# Altium project ControlBoard.PrjPcb
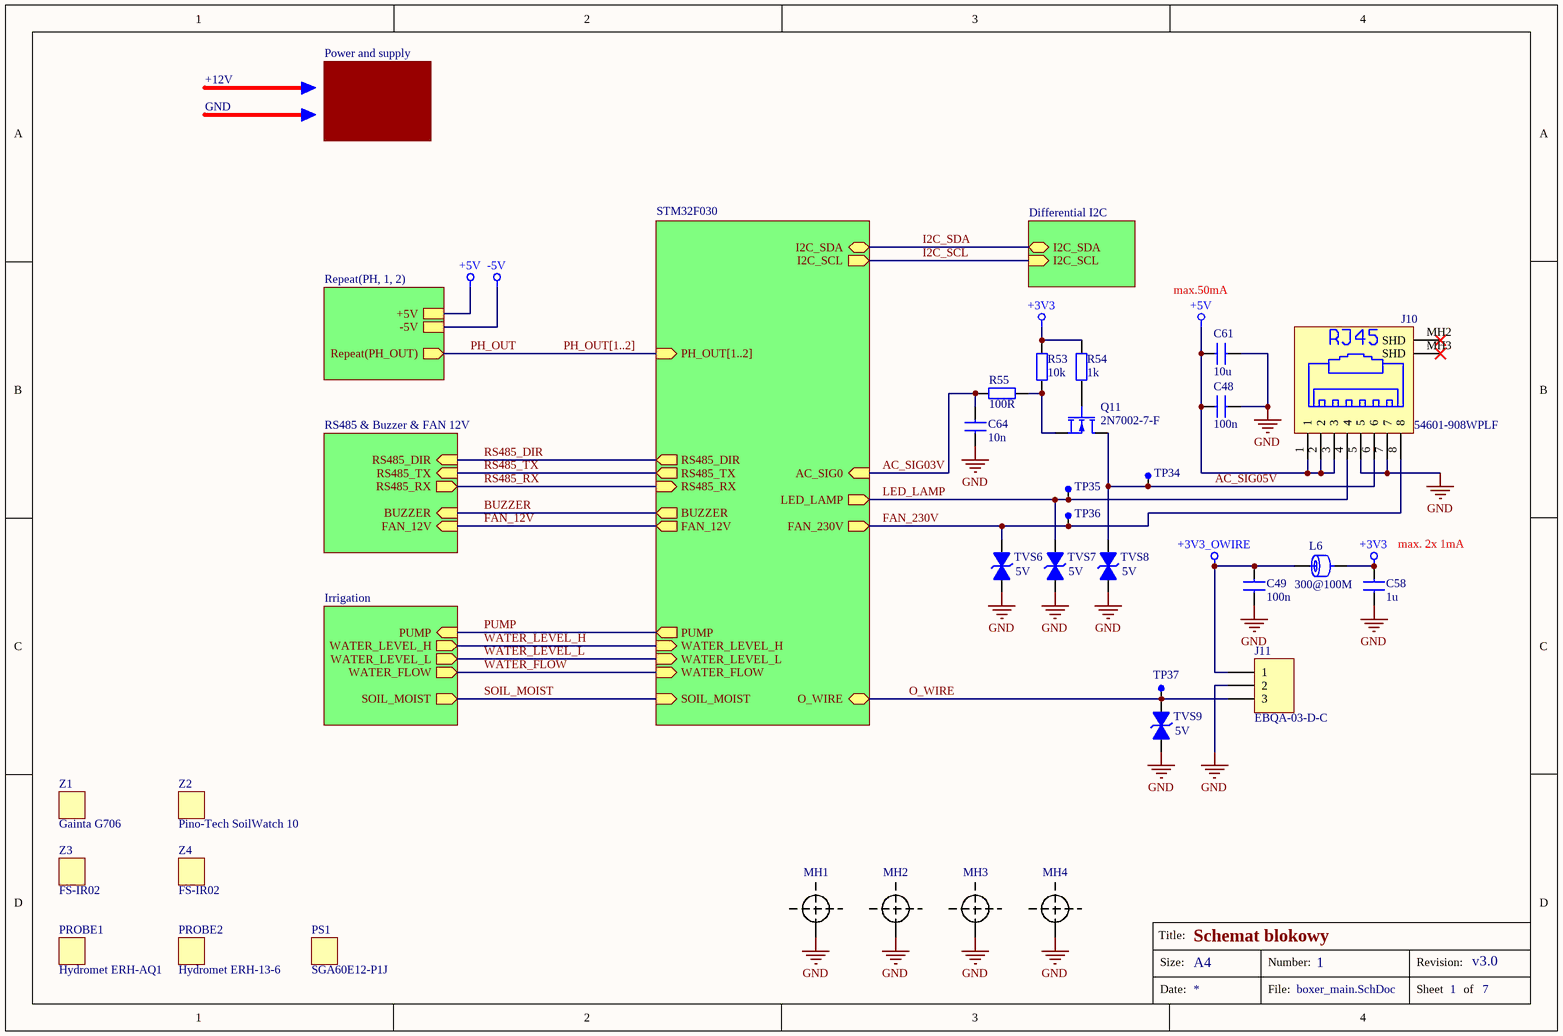
[diagram p0: boxer_main.SchDoc]
Revision: v3.0
7 sheets, 264 parts. Net scope: hierarchical (ports join the sheet entries above them; power ports are global).
Board file: PCB.PcbDoc
Sheets:
  boxer_main.SchDoc
    Irrigation = boxer_irrigation.SchDoc
    STM32F030 = boxer_stm32.SchDoc
    PH1 = boxer_pH.SchDoc
    PH2 = boxer_pH.SchDoc
    Power and supply = boxer_supply.SchDoc
    RS485 & Buzzer & FAN 12V = boxer_analog.SchDoc
    Differential I2C = boxer_I2C_diff.SchDoc

## Sheet boxer_main.SchDoc: Schemat blokowy
size A4; DrawnBy: Damian Dolewski; Engineer: Damian Dolewski; DocumentNumber: 1; Revision: v3.0; SheetNumber: 1; SheetTotal: 7

### Parts
C48  value 100n  [C_0805]  (hidden comment: Capacitor)
C49  value 100n  [C_0805]  (hidden comment: Capacitor)
C58  value 1u  [C_0805]  (hidden comment: C0805C105K4RACAUTO)
C61  value 10u  [C_1206]  (hidden comment: Capacitor)
C64  value 10n  [C_0805]  (hidden comment: Capacitor)
J10  54601-908WPLF  [RJ45_54601-908WPLF]
J11  EBQA-03-D-C  [284512-3]
L6  value 300@100M  [L_0805]  (hidden comment: 742792031)
MH1  Mounting hole  [MH_M2.5]  (value not drawn)
MH2  Mounting hole  [MH_M2.5]  (value not drawn)
MH3  Mounting hole  [MH_M2.5]  (value not drawn)
MH4  Mounting hole  [MH_M2.5]  (value not drawn)
PROBE1  Hydromet ERH-AQ1  (mechanical)
PROBE2  Hydromet ERH-13-6  (mechanical)
PS1  SGA60E12-P1J  (mechanical)
Q11  2N7002-7-F  [SOT-23]
R53  value 10k  [R_1206]  (hidden comment: Resistor)
R54  value 1k  [R_0805]  (hidden comment: Resistor)
R55  value 100R  [R_0805]  (hidden comment: Resistor)
TP34  TEST PAD  [PIN]  (value not drawn)
TP35  TEST PAD  [PIN]  (value not drawn)
TP36  TEST PAD  [PIN]  (value not drawn)
TP37  TEST PAD  [PIN]  (value not drawn)
TVS6  value 5V  [D_SMA]  (hidden comment: SMAJ5.0ALFCT-ND)
TVS7  value 5V  [D_SMA]  (hidden comment: SMAJ5.0ALFCT-ND)
TVS8  value 5V  [D_SMA]  (hidden comment: SMAJ5.0ALFCT-ND)
TVS9  value 5V  [D_SMA]  (hidden comment: SMAJ5.0ALFCT-ND)
Z1  Gainta G706  [Gainta G706]
Z2  Pino-Tech SoilWatch 10  (mechanical)
Z3  FS-IR02  (mechanical)
Z4  FS-IR02  (mechanical)

### Sub-sheets
Differential I2C = boxer_I2C_diff.SchDoc: I2C_SDA (bidir), I2C_SCL (in)
Irrigation = boxer_irrigation.SchDoc: SOIL_MOIST (out), PUMP (in), WATER_FLOW (out), WATER_LEVEL_H (out), WATER_LEVEL_L (out)
Power and supply = boxer_supply.SchDoc: no entries
Repeat(PH, 1, 2) = boxer_pH.SchDoc: Repeat(PH_OUT) (out), +5V, -5V
RS485 & Buzzer & FAN 12V = boxer_analog.SchDoc: BUZZER (in), FAN_12V (in), RS485_TX (in), RS485_RX (out), RS485_DIR (in)
STM32F030 = boxer_stm32.SchDoc: WATER_FLOW (in), SOIL_MOIST (in), BUZZER (out), PUMP (out), FAN_12V (out), O_WIRE (bidir), FAN_230V (out), AC_SIG0 (in), I2C_SDA (bidir), LED_LAMP (out), I2C_SCL (out), RS485_DIR (out), RS485_TX (out), RS485_RX (in), PH_OUT[1..2] (in), WATER_LEVEL_H (in), WATER_LEVEL_L (in)

### Nets
+3V3: C58.2 L6.2 R53.2 R54.2
+3V3_OWIRE: C49.1 J11.1 L6.1
+5V: C48.2 C61.2 J10.1 J10.2 J10.3 ; sheet Repeat(PH, 1, 2)/+5V
GND: C48.1 C49.2 C58.1 C61.1 C64.2 J10.5 J10.7 J11.2 MH1.MH MH2.MH MH3.MH MH4.MH TVS6.1(A) TVS7.1(A) TVS8.1(A) TVS9.1(A)
AC_SIG03V: C64.1 R55.2 ; sheet STM32F030/AC_SIG0
AC_SIG05V: J10.6 Q11.3(D) TP34.1 TVS8.2(K)
BUZZER: sheet STM32F030/BUZZER, sheet RS485 & Buzzer & FAN 12V/BUZZER
FAN_12V: sheet STM32F030/FAN_12V, sheet RS485 & Buzzer & FAN 12V/FAN_12V
FAN_230V: J10.8 TP36.1 TVS6.2(K) ; sheet STM32F030/FAN_230V
I2C_SCL: sheet STM32F030/I2C_SCL, sheet Differential I2C/I2C_SCL
I2C_SDA: sheet STM32F030/I2C_SDA, sheet Differential I2C/I2C_SDA
LED_LAMP: J10.4 TP35.1 TVS7.2(K) ; sheet STM32F030/LED_LAMP
O_WIRE: J11.3 TP37.1 TVS9.2(K) ; sheet STM32F030/O_WIRE
PH_OUT: sheet Repeat(PH, 1, 2)/Repeat(PH_OUT)
PUMP: sheet Irrigation/PUMP, sheet STM32F030/PUMP
RS485_DIR: sheet STM32F030/RS485_DIR, sheet RS485 & Buzzer & FAN 12V/RS485_DIR
RS485_RX: sheet STM32F030/RS485_RX, sheet RS485 & Buzzer & FAN 12V/RS485_RX
RS485_TX: sheet STM32F030/RS485_TX, sheet RS485 & Buzzer & FAN 12V/RS485_TX
SOIL_MOIST: sheet Irrigation/SOIL_MOIST, sheet STM32F030/SOIL_MOIST
WATER_FLOW: sheet Irrigation/WATER_FLOW, sheet STM32F030/WATER_FLOW
WATER_LEVEL_H: sheet Irrigation/WATER_LEVEL_H, sheet STM32F030/WATER_LEVEL_H
WATER_LEVEL_L: sheet Irrigation/WATER_LEVEL_L, sheet STM32F030/WATER_LEVEL_L
NetQ11_1: Q11.1(G) R54.1
NetQ11_2: Q11.2(S) R53.1 R55.1

Not connected (* = marked no-connect by the designer): J10 MH2(SHD)* MH3(SHD)*

### Buses and harness runs
bus PH_OUT[1..2] = sheet STM32F030/PH_OUT[1..2]

### Notes on the sheet
- +12V
- GND
- max.50mA
- (near C58) max. 2x 1mA
- Title:
- Size:
- A4
- Number:
- Revision:
- Date:
- File:
- Sheet
- of

### Library data of the parts
C58 = Capacitor
J10 = RJ45-8: RJ45 Socket, 8pin, No Key, Molex MX-95001-2881; Value: 54601-908WPLF
J11 = Header 3: Header, 3-Pin; Value: EBQA-03-D-C
L6 = FB: Ferrite Bead
MH1-MH4 = Mounting hole: Mounting hole 2.3mm
PROBE1 = ERH-AQ1: Hydromet ERH-AQ1 Water pH probe
PROBE2 = ERH-13-6: Hydromet ERH-AQ1 Soil pH probe
PS1 = EPS-45-12
Q11 = MOSFET-N: N-Channel MOSFET; Value: 2N7002-7-F
TP34-TP37 = TEST_PAD
TVS6-TVS9 = Transil
Z1 = ENCLOSURE
Z2 = SoilWatch10: Capacitance Water Soil Sensor, 75MHz; Vcc - 3,1- 5VDC; Vout - analog 0-3VDC; Ioutmax = 24mA; Temp. = 2*C - 45*C; IP67
Z3 Z4 = FS-IR02: IR Liquid Level Sensor, Vcc 5VDC; Iout = 12mA; Temp. = -25*C - 105*C

## Sheet boxer_irrigation.SchDoc: Irrigation Module
size A3; DrawnBy: Damian Dolewski; DocumentNumber: 1; Revision: v3.0; SheetNumber: 5; SheetTotal: 7
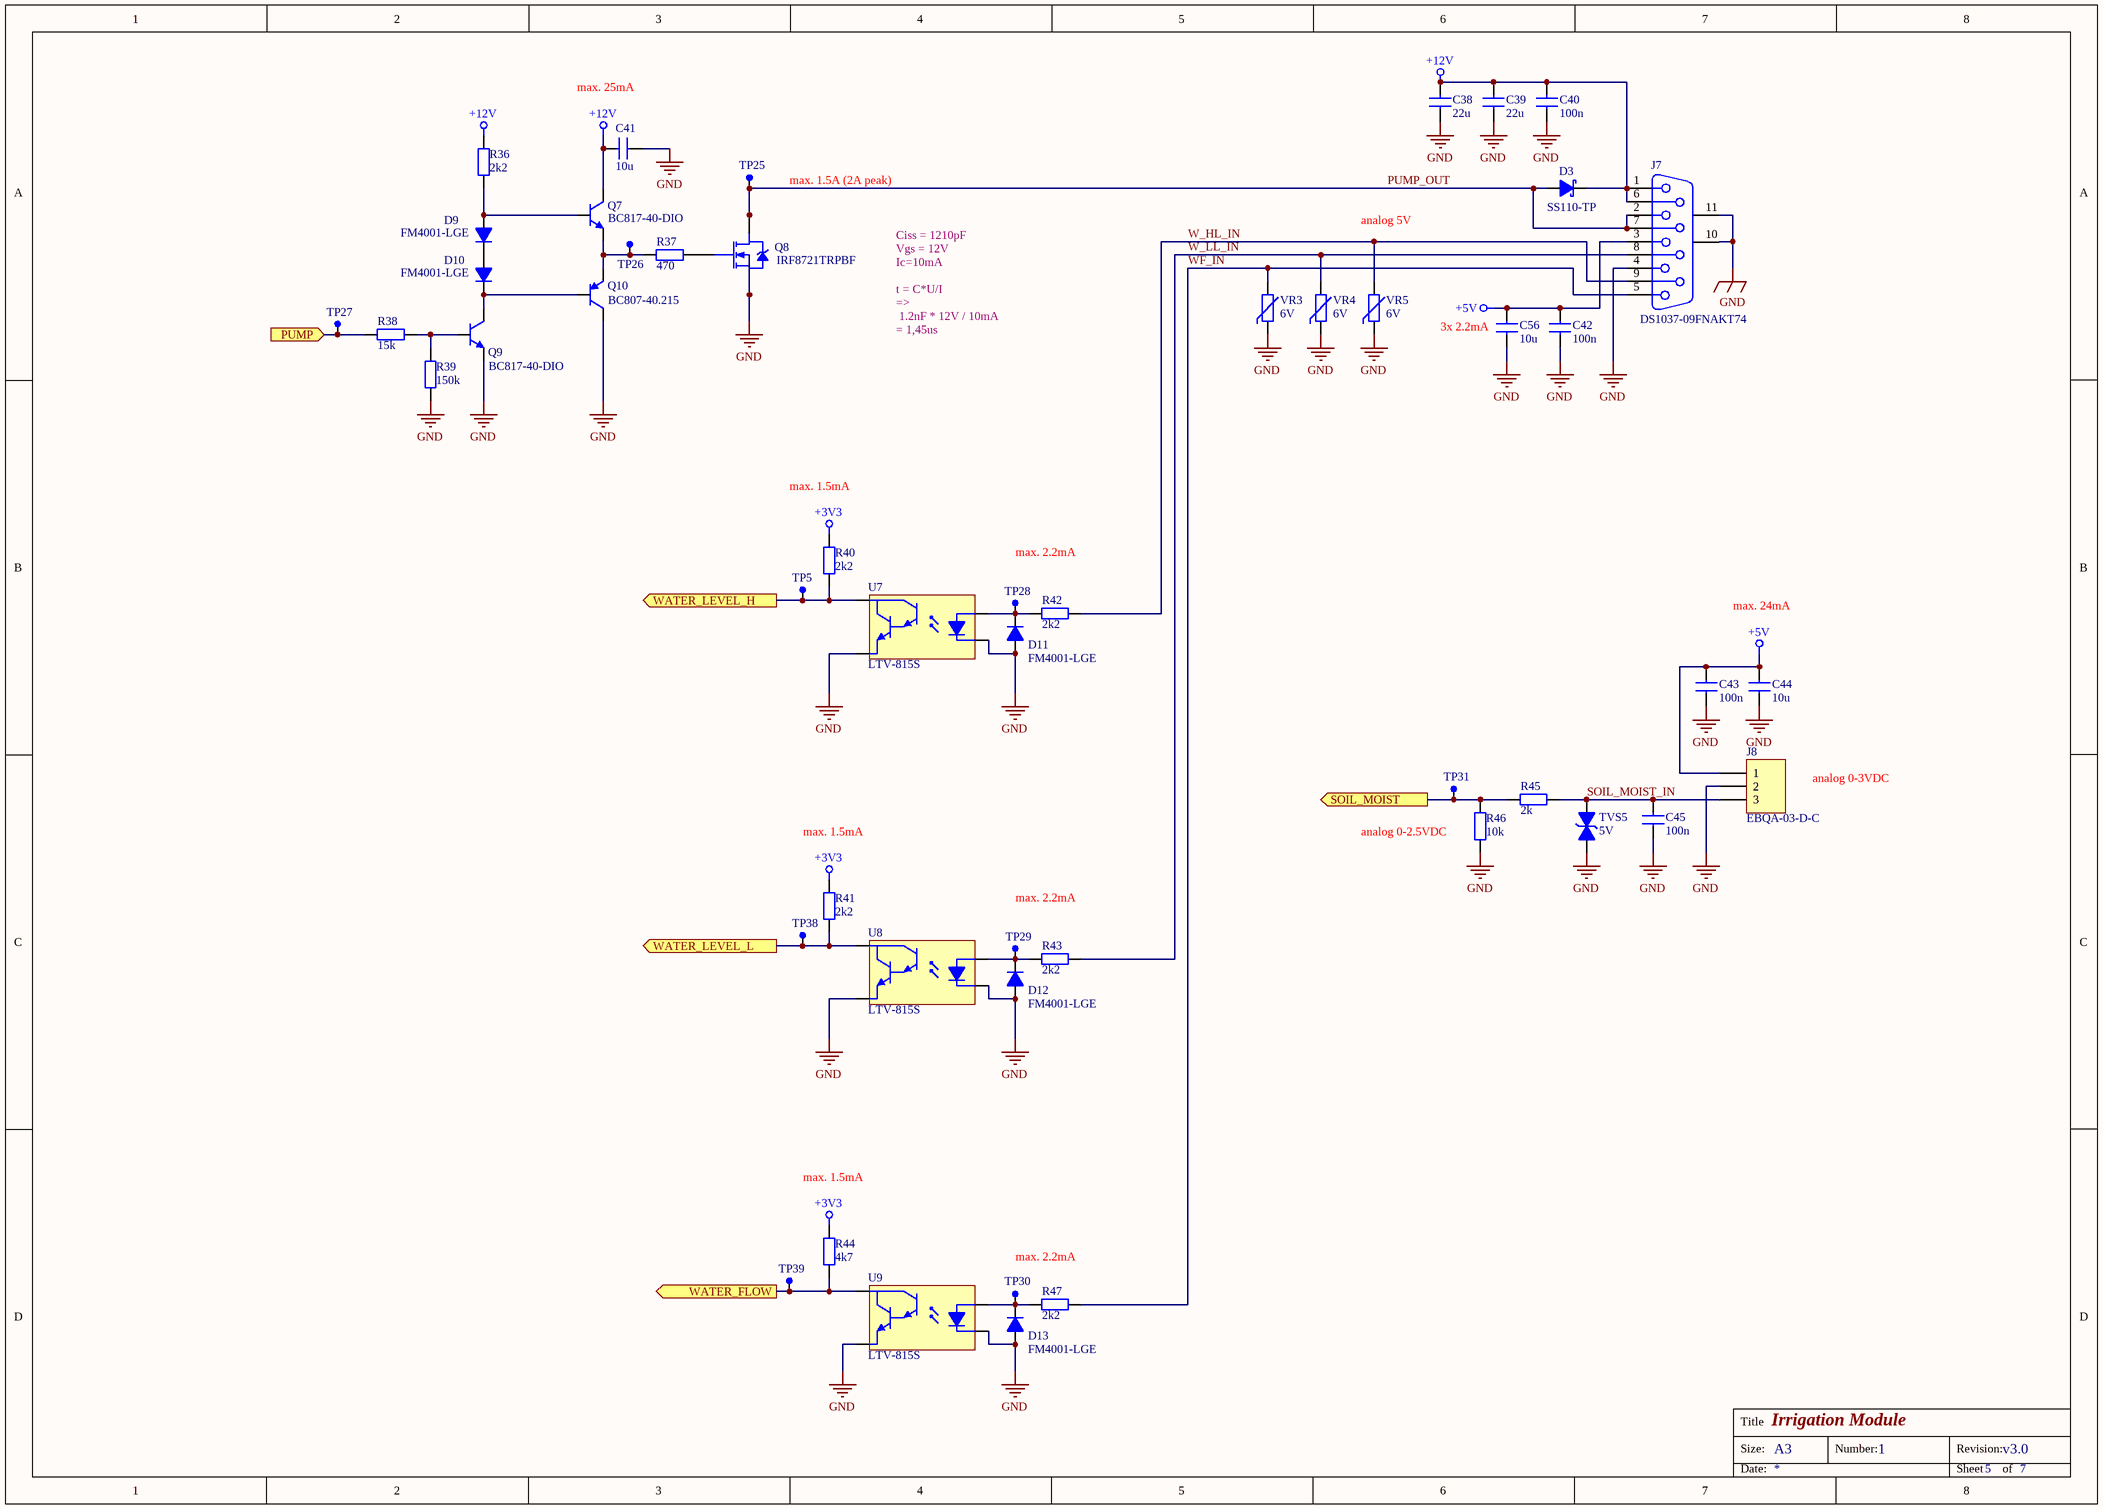
[diagram p1: boxer_irrigation.SchDoc]

### Parts
C38  value 22u  [C_1206]  (hidden comment: TME: CL31A226MOCLNNC)
C39  value 22u  [C_1206]  (hidden comment: TME: CL31A226MOCLNNC)
C40  value 100n  [C_0805]  (hidden comment: Capacitor)
C41  value 10u  [C_1206]  (hidden comment: TME: CL31A226MOCLNNC)
C42  value 100n  [C_0805]  (hidden comment: Capacitor)
C43  value 100n  [C_0805]  (hidden comment: Capacitor)
C44  value 10u  [C_1206]  (hidden comment: TME: CL31A226MOCLNNC)
C45  value 100n  [C_0805]  (hidden comment: Capacitor)
C56  value 10u  [C_1206]  (hidden comment: TME: CL31A226MOCLNNC)
D3  SS110-TP  [D_SMA]
D9  FM4001-LGE  [SOD123F]
D10  FM4001-LGE  [SOD123F]
D11  FM4001-LGE  [SOD123F]
D12  FM4001-LGE  [SOD123F]
D13  FM4001-LGE  [SOD123F]
J7  DS1037-09FNAKT74  [DB9]
J8  EBQA-03-D-C  [284512-3]
Q7  BC817-40-DIO  [SOT-23]
Q8  IRF8721TRPBF  [SO8]
Q9  BC817-40-DIO  [SOT-23]
Q10  BC807-40.215  [SOT-23]
R36  value 2k2  [R_0805]  (hidden comment: Resistor)
R37  value 470  [R_1206]  (hidden comment: Resistor)
R38  value 15k  [R_0805]  (hidden comment: Resistor)
R39  value 150k  [R_0805]  (hidden comment: Resistor)
R40  value 2k2  [R_0805]  (hidden comment: Resistor)
R41  value 2k2  [R_0805]  (hidden comment: Resistor)
R42  value 2k2  [R_0805]  (hidden comment: Resistor)
R43  value 2k2  [R_0805]  (hidden comment: Resistor)
R44  value 4k7  [R_0805]  (hidden comment: Resistor)
R45  value 2k  [R_0805]  (hidden comment: Resistor)
R46  value 10k  [R_1206]  (hidden comment: Resistor)
R47  value 2k2  [R_0805]  (hidden comment: Resistor)
TP5  TEST PAD  [PIN]  (value not drawn)
TP25  TEST PAD  [PIN]  (value not drawn)
TP26  TEST PAD  [PIN]  (value not drawn)
TP27  TEST PAD  [PIN]  (value not drawn)
TP28  TEST PAD  [PIN]  (value not drawn)
TP29  TEST PAD  [PIN]  (value not drawn)
TP30  TEST PAD  [PIN]  (value not drawn)
TP31  TEST PAD  [PIN]  (value not drawn)
TP38  TEST PAD  [PIN]  (value not drawn)
TP39  TEST PAD  [PIN]  (value not drawn)
TVS5  value 5V  [D_SMA]  (hidden comment: SMAJ5.0ALFCT-ND)
U7  LTV-815S  [SO4]
U8  LTV-815S  [SO4]
U9  LTV-815S  [SO4]
VR3  value 6V  [VR_0805]  (hidden comment: AMCV-0805-260-C800N-T)
VR4  value 6V  [VR_0805]  (hidden comment: AMCV-0805-260-C800N-T)
VR5  value 6V  [VR_0805]  (hidden comment: AMCV-0805-260-C800N-T)

### Ports
PUMP (in), SOIL_MOIST (out), WATER_FLOW (out), WATER_LEVEL_H (out), WATER_LEVEL_L (out)

### Nets
+3V3: R40.2 R41.2 R44.2
+5V: C42.2 C43.2 C44.2 C56.1 J7.3 J8.1
+12V: C38.2 C39.2 C40.2 C41.1 D3.2(K) J7.1 J7.6 Q7.3(C) R36.2
GND: C38.1 C39.1 C40.1 C41.2 C42.1 C43.1 C44.1 C45.1 C56.2 D11.1(A) D12.1(A) D13.1(A) J7.4 J7.10(MH1) J7.11(MH2) J8.2 Q8.1(S) Q8.2(S) Q8.3(S) Q9.2(E) Q10.3(C) R39.1 R46.1 TVS5.1(A) U7.2(K) U7.4(E) U8.2(K) U8.4(E) U9.2(K) U9.4(E) VR3.2 VR4.2 VR5.2
PUMP: R38.1 TP27.1 ; port PUMP
PUMP_OUT: D3.1(A) J7.2 J7.7 Q8.5(D) Q8.6(D) Q8.7(D) Q8.8(D) TP25.1
SOIL_MOIST: R45.1 R46.2 TP31.1 ; port SOIL_MOIST
SOIL_MOIST_IN: C45.2 J8.3 R45.2 TVS5.2(K)
W_HL_IN: J7.9 R42.1 VR5.1
W_LL_IN: J7.8 R43.1 VR4.1
WATER_FLOW: R44.1 TP39.1 U9.3(C) ; port WATER_FLOW
WATER_LEVEL_H: R40.1 TP5.1 U7.3(C) ; port WATER_LEVEL_H
WATER_LEVEL_L: R41.1 TP38.1 U8.3(C) ; port WATER_LEVEL_L
WF_IN: J7.5 R47.1 VR3.1
NetD9_1: D9.1(A) Q7.1(B) R36.1
NetD9_2: D9.2(K) D10.1(A)
NetD10_2: D10.2(K) Q9.3(C) Q10.1(B)
NetD11_2: D11.2(K) R42.2 TP28.1 U7.1(A)
NetD12_2: D12.2(K) R43.2 TP29.1 U8.1(A)
NetD13_2: D13.2(K) R47.2 TP30.1 U9.1(A)
NetQ7_2: Q7.2(E) Q10.2(E) R37.2 TP26.1
NetQ8_4: Q8.4(G) R37.1
NetQ9_1: Q9.1(B) R38.2 R39.2

### Notes on the sheet
- (near C41) max. 25mA
- max. 1.5A (2A peak)
- analog 5V
- Ciss = 1210pF
  Vgs = 12V
  Ic=10mA
  t = C*U/I
  =>
  1.2nF * 12V / 10mA
  = 1,45us
- (near C56) 3x 2.2mA
- (near R40) max. 1.5mA
- max. 2.2mA
- max. 24mA
- analog 0-3VDC
- (near R41) max. 1.5mA
- analog 0-2.5VDC
- (near R44) max. 1.5mA
- Title
- Size:
- A3
- Number:
- Revision:
- Date:
- Sheet
- of

### Library data of the parts
C38 C39 C41 C44 C56 = Capacitor
D3 = Diode Schottky: Schottky Diode; Value: SS110-TP
D9-D13 = Diode: Value: FM4001-LGE
J7 = DB9: Receptacle Assembly, 9 Position, Right Angle; Value: DS1037-09FNAKT74
J8 = Header 3: Header, 3-Pin; Value: EBQA-03-D-C
Q7 Q9 = NPN: NPN Bipolar Transistor; Value: BC817-40-DIO
Q8 = MOSFET-N_SO8: N-Channel MOSFET; Value: IRF8721TRPBF
Q10 = PNP: Value: BC807-40.215
TP5 TP25-TP31 TP38 TP39 = TEST_PAD: PAD 1.5mm
TVS5 = Transil
U7-U9 = Optocoupler_Darlington: Optocoupler Darlington NPN; Value: LTV-815S
VR3-VR5 = Varistor: 34.5V 20A Varistor 1 Circuit Surface Mount, MLCV 0805 (2012 Metric)

## Sheet boxer_stm32.SchDoc: Microcontroller STM32F030
size A4; DrawnBy: Damian Dolewski; Engineer: Damian Dolewski; DocumentNumber: 2; Revision: v3.0; SheetNumber: 2; SheetTotal: 7
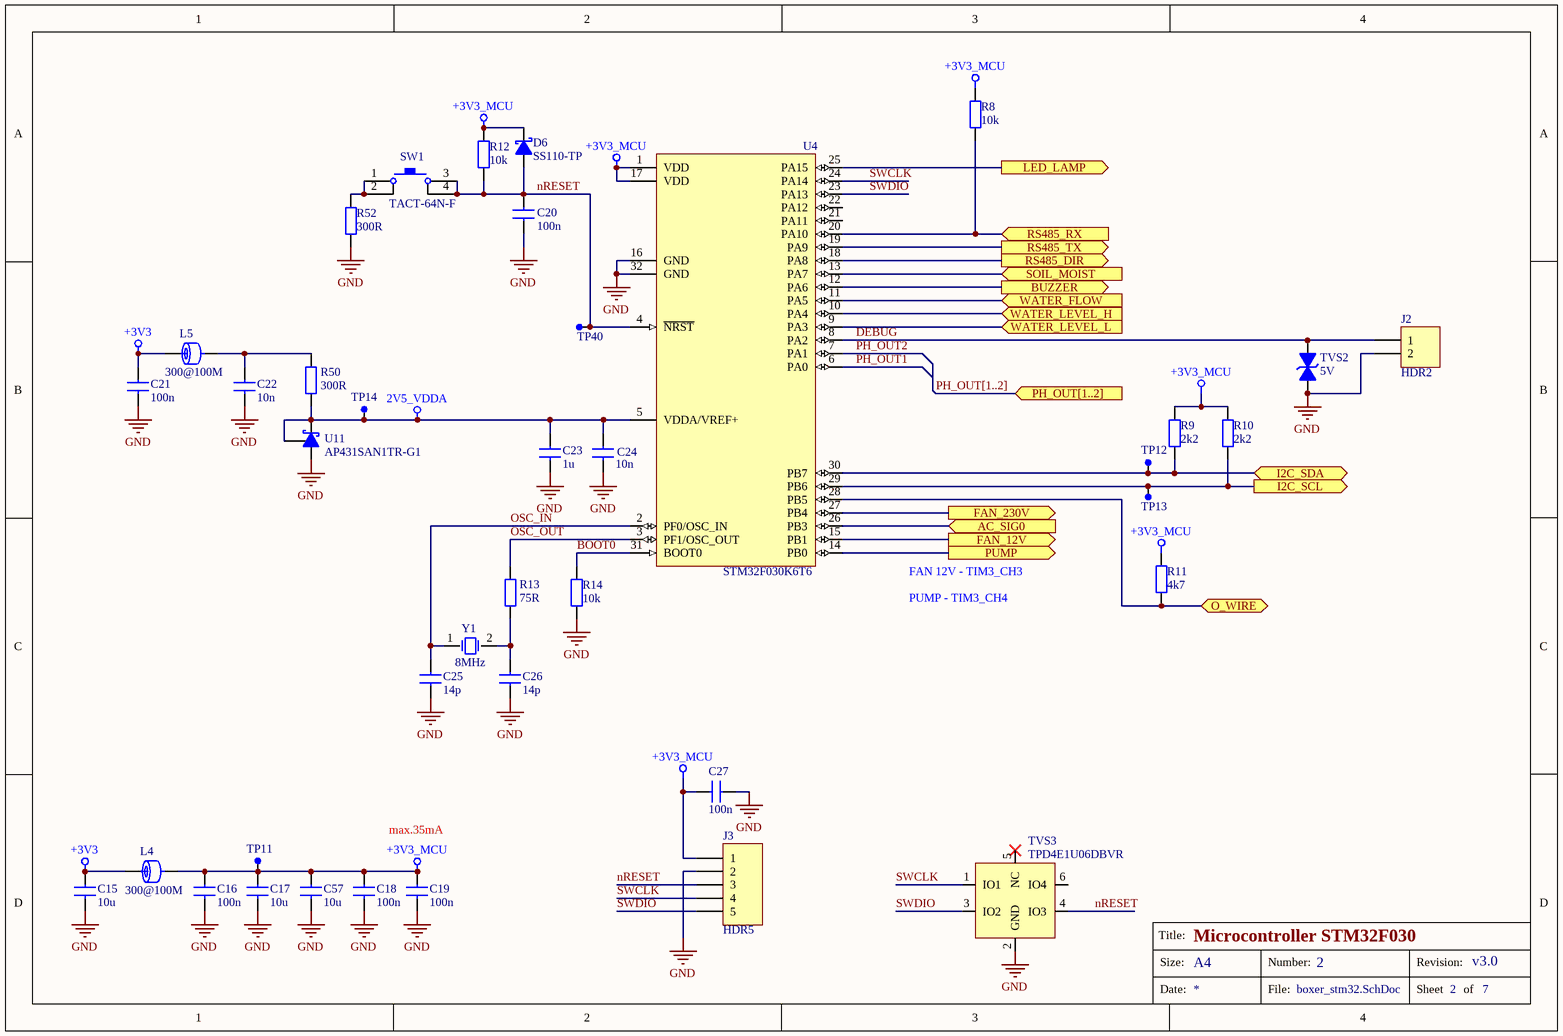
[diagram p2: boxer_stm32.SchDoc]

### Parts
C15  value 10u  [C_1206]  (hidden comment: Capacitor)
C16  value 100n  [C_0805]  (hidden comment: Capacitor)
C17  value 10u  [C_1206]  (hidden comment: TME: CL31A226MOCLNNC)
C18  value 100n  [C_0805]  (hidden comment: Capacitor)
C19  value 100n  [C_0805]  (hidden comment: Capacitor)
C20  value 100n  [C_0805]  (hidden comment: Capacitor)
C21  value 100n  [C_0805]  (hidden comment: Capacitor)
C22  value 10n  [C_0805]  (hidden comment: Capacitor)
C23  value 1u  [C_0805]  (hidden comment: C0805C105K4RACAUTO)
C24  value 10n  [C_0805]  (hidden comment: Capacitor)
C25  value 14p  [C_0805]  (hidden comment: 490-14443-1-ND)
C26  value 14p  [C_0805]  (hidden comment: 490-14443-1-ND)
C27  value 100n  [C_0805]  (hidden comment: Capacitor)
C57  value 10u  [C_1206]  (hidden comment: TME: CL31A226MOCLNNC)
D6  SS110-TP  [D_1206]
J2  value HDR2  [header 2.54mm 2pin]  (hidden comment: Header 2.54mm)
J3  value HDR5  [header 2.54mm 5pin]  (hidden comment: Header 2.54mm)
L4  value 300@100M  [L_0805]  (hidden comment: 742792031)
L5  value 300@100M  [L_0805]  (hidden comment: 742792031)
R8  value 10k  [R_1206]  (hidden comment: Resistor)
R9  value 2k2  [R_0805]  (hidden comment: Resistor)
R10  value 2k2  [R_0805]  (hidden comment: Resistor)
R11  value 4k7  [R_0805]  (hidden comment: Resistor)
R12  value 10k  [R_1206]  (hidden comment: Resistor)
R13  value 75R  [R_0805]  (hidden comment: Resistor)
R14  value 10k  [R_1206]  (hidden comment: Resistor)
R50  value 300R  [R_0805]  (hidden comment: Resistor)
R52  value 300R  [R_0805]  (hidden comment: Resistor)
SW1  TACT-64N-F  [SPST_NO_1301]
TP11  TEST PAD  [PIN]  (value not drawn)
TP12  TEST PAD  [PIN]  (value not drawn)
TP13  TEST PAD  [PIN]  (value not drawn)
TP14  TEST PAD  [PIN]  (value not drawn)
TP40  TEST PAD  [PIN]  (value not drawn)
TVS2  value 5V  [D_SMA]  (hidden comment: SMAJ5.0ALFCT-ND)
TVS3  TPD4E1U06DBVR  [SOT23-6]
U4  STM32F030K6T6  [LQFP-32]
U11  AP431SAN1TR-G1  [SOT-23]
Y1  value 8MHz  [CFPX_217]  (hidden comment: 7A-8.000MAAE-T)

### Ports
AC_SIG0 (in), BUZZER (out), FAN_12V (out), FAN_230V (out), I2C_SCL (out), I2C_SDA (bidir), LED_LAMP (out), O_WIRE (bidir), PH_OUT[1..2] (in), PUMP (out), RS485_DIR (out), RS485_RX (in), RS485_TX (out), SOIL_MOIST (in), WATER_FLOW (in), WATER_LEVEL_H (in), WATER_LEVEL_L (in)

### Nets
2V5_VDDA: C23.2 C24.2 R50.1 TP14.1 U4.5(VDDA/VREF+) U11.1(REF) U11.2(K)
+3V3: C15.2 C21.2 L4.1 L5.1
+3V3_MCU: C16.2 C17.2 C18.2 C19.2 C27.1 C57.1 D6.2(K) J3.1 L4.2 R8.2 R9.2 R10.2 R11.1 R12.2 TP11.1 U4.1(VDD) U4.17(VDD)
GND: C15.1 C16.1 C17.1 C18.1 C19.1 C20.1 C21.1 C22.1 C23.1 C24.1 C25.1 C26.1 C27.2 C57.2 J2.2 J3.2 R14.1 R52.2 TVS2.1(A) TVS3.2(GND) U4.16(GND) U4.32(GND) U11.3(A)
AC_SIG03V: U4.26(PB3) ; port AC_SIG0
BOOT0: R14.2 U4.31(BOOT0)
BUZZER: U4.12(PA6) ; port BUZZER
DEBUG: J2.1 TVS2.2(K) U4.8(PA2)
FAN_12V: U4.15(PB1) ; port FAN_12V
FAN_230V: U4.27(PB4) ; port FAN_230V
I2C_SCL: R10.1 TP13.1 U4.29(PB6) ; port I2C_SCL
I2C_SDA: R9.1 TP12.1 U4.30(PB7) ; port I2C_SDA
LED_LAMP: U4.25(PA15) ; port LED_LAMP
nRESET: C20.2 D6.1(A) J3.3 R12.1 SW1.3 SW1.4 TP40.1 TVS3.4(IO3) U4.4(~{NRST})
O_WIRE: R11.2 U4.28(PB5) ; port O_WIRE
OSC_IN: C25.2 U4.2(PF0/OSC_IN) Y1.1(OSC1)
OSC_OUT: R13.2 U4.3(PF1/OSC_OUT)
PH_OUT1: U4.6(PA0)
PH_OUT2: U4.7(PA1)
PUMP: U4.14(PB0) ; port PUMP
RS485_DIR: U4.18(PA8) ; port RS485_DIR
RS485_RX: R8.1 U4.20(PA10) ; port RS485_RX
RS485_TX: U4.19(PA9) ; port RS485_TX
SOIL_MOIST: U4.13(PA7) ; port SOIL_MOIST
SWCLK: J3.4 TVS3.1(IO1) U4.24(PA14)
SWDIO: J3.5 TVS3.3(IO2) U4.23(PA13)
WATER_FLOW: U4.11(PA5) ; port WATER_FLOW
WATER_LEVEL_H: U4.10(PA4) ; port WATER_LEVEL_H
WATER_LEVEL_L: U4.9(PA3) ; port WATER_LEVEL_L
NetC22_2: C22.2 L5.2 R50.2
NetC26_2: C26.2 R13.1 Y1.2(OSC2)
NetR52_1: R52.1 SW1.1 SW1.2

Not connected (* = marked no-connect by the designer): TVS3 5(NC)* 6(IO4); U4 21(PA11) 22(PA12)

### Buses and harness runs
bus PH_OUT[1..2] = port PH_OUT[1..2]

### Notes on the sheet
- FAN 12V - TIM3_CH3
- PUMP - TIM3_CH4
- max.35mA
- Title:
- Size:
- A4
- Number:
- Revision:
- Date:
- File:
- Sheet
- of

### Library data of the parts
C17 C23 C25 C26 C57 = Capacitor
D6 = Diode Schottky: Schottky Diode; Value: SS110-TP
J2 = Header 2: Header, 2-Pin
J3 = Header 5: Header, 5-Pin
L4 L5 = FB: Ferrite Bead
SW1 = Switch-PB 4 Pins: Switch 4 Pins; Value: TACT-64N-F
TP11 TP14 TP40 = TEST_PAD: PAD 1.5mm
TP12 TP13 = TEST_PAD
TVS2 = Transil
TVS3 = Transil Array_2: TVS Array; Value: TPD4E1U06DBVR
U4 = STM32F030C8T6: Microcontroler ARM; Flash:32kB; 48MHz; SRAM:4kB; LQFP32; Value: STM32F030K6T6
U11 = REF_VOLTAGE: Value: AP431SAN1TR-G1
Y1 = XTAL: Crystal Oscillator

## Sheet boxer_pH.SchDoc: Water and Soil pH meter
size A4; DrawnBy: Damian Dolewski; Engineer: Damian Dolewski; DocumentNumber: 3; Revision: v3.0; SheetNumber: 3; SheetTotal: 7
Used 2 times, as channels PH1, PH2. Parts and nets are listed once, with the designators drawn on the sheet.
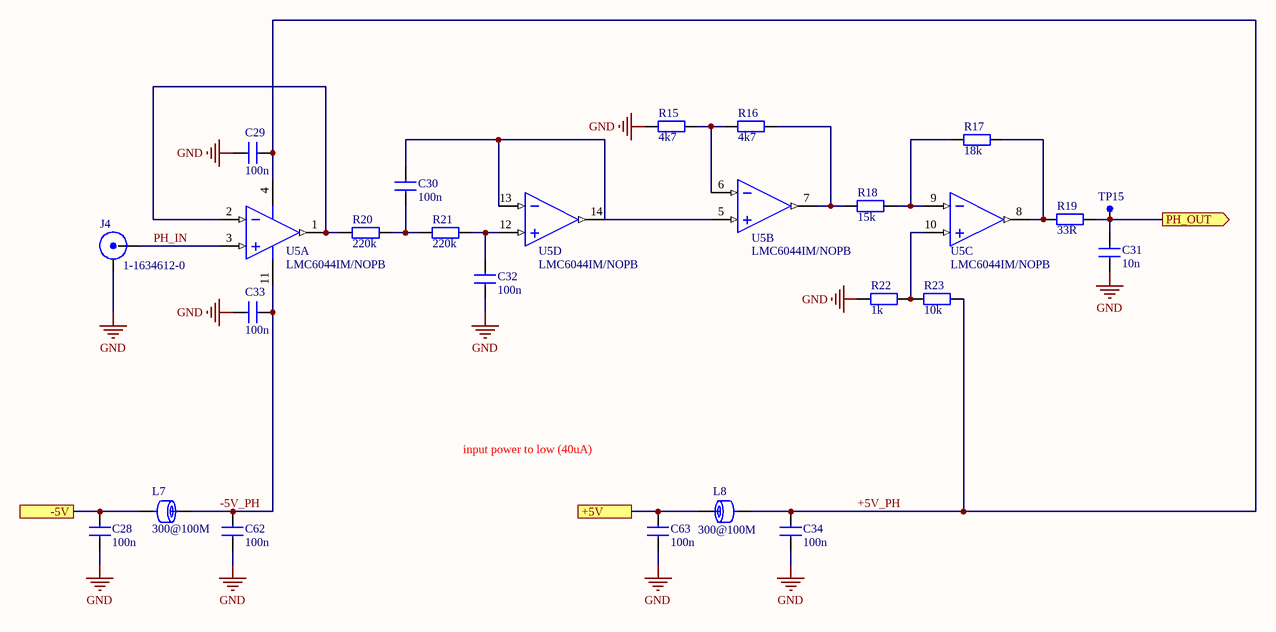
[diagram p3: boxer_pH.SchDoc]

### Parts
C28  value 100n  [C_0805]  (hidden comment: Capacitor)
C29  value 100n  [C_0805]  (hidden comment: Capacitor)
C30  value 100n  [C_0805]  (hidden comment: Capacitor)
C31  value 10n  [C_0805]  (hidden comment: Capacitor)
C32  value 100n  [C_0805]  (hidden comment: Capacitor)
C33  value 100n  [C_0805]  (hidden comment: Capacitor)
C34  value 100n  [C_0805]  (hidden comment: Capacitor)
C62  value 100n  [C_0805]  (hidden comment: Capacitor)
C63  value 100n  [C_0805]  (hidden comment: Capacitor)
J4  1-1634612-0  [1-1634612-0]
L7  value 300@100M  [L_0805]  (hidden comment: 742792031)
L8  value 300@100M  [L_0805]  (hidden comment: 742792031)
R15  value 4k7  [R_0805]  (hidden comment: Resistor)
R16  value 4k7  [R_0805]  (hidden comment: Resistor)
R17  value 18k  [R_0805]  (hidden comment: Resistor)
R18  value 15k  [R_0805]  (hidden comment: Resistor)
R19  value 33R  [R_0805]  (hidden comment: Resistor)
R20  value 220k  [R_0805]  (hidden comment: Resistor)
R21  value 220k  [R_0805]  (hidden comment: Resistor)
R22  value 1k  [R_0805]  (hidden comment: Resistor)
R23  value 10k  [R_1206]  (hidden comment: Resistor)
TP15  TEST PAD  [PIN]  (value not drawn)
U5  LMC6044IM/NOPB  [SO14]  (parts A,B,C,D of 4)

### Ports
+5V, -5V, PH_OUT (out)

### Nets
GND: C28.1 C29.1 C31.1 C32.1 C33.1 C34.1 C62.1 C63.1 J4.2(GND) R15.1 R22.1
+5V: C63.2 L8.1 ; port +5V
+5V_PH: C29.2 C34.2 L8.2 R23.2 U5.4(VCC+)
-5V: C28.2 L7.2 ; port -5V
-5V_PH: C33.2 C62.2 L7.1 U5.11(VCC-)
PH_IN: J4.1(OUT) U5.3(IN+)
PH_OUT: C31.2 R19.2 TP15.1 ; port PH_OUT
NetC30_1: C30.1 R20.2 R21.1
NetC30_2: C30.2 U5.5(IN+) U5.13(IN-) U5.14(OUT)
NetC32_2: C32.2 R21.2 U5.12(IN+)
NetR15_2: R15.2 R16.1 U5.6(IN-)
NetR16_2: R16.2 R18.1 U5.7(OUT)
NetR17_1: R17.1 R18.2 U5.9(IN-)
NetR17_2: R17.2 R19.1 U5.8(OUT)
NetR20_1: R20.1 U5.1(OUT) U5.2(IN-)
NetR22_2: R22.2 R23.1 U5.10(IN+)

### Channels
PH1: designators end in A; ports +5V=+5V -5V=-5V PH_OUT=PH_OUT1
PH2: designators end in B; ports +5V=+5V -5V=-5V PH_OUT=PH_OUT2

### Notes on the sheet
- input power to low (40uA)
- Title:
- Size:
- A4
- Number:
- Revision:
- Date:
- File:
- Sheet
- of

### Library data of the parts
J4 = BNC: BNC Elbow Connector; Value: 1-1634612-0
L7 L8 = FB: Ferrite Bead
TP15 = TEST_PAD: PAD 1.5mm
U5 = LMC6044IM/NOPB: CMOS Quad Micropower Operational Amplifier, 14-pin Narrow SOIC; Value: LMC6044IM/NOPB

## Sheet boxer_supply.SchDoc: Power and Supply (+5V, -5V, +3.3V)
size A4; DrawnBy: Damian Dolewski; Engineer: Damian Dolewski; DocumentNumber: 6; Revision: v3.0; SheetNumber: 6; SheetTotal: 7
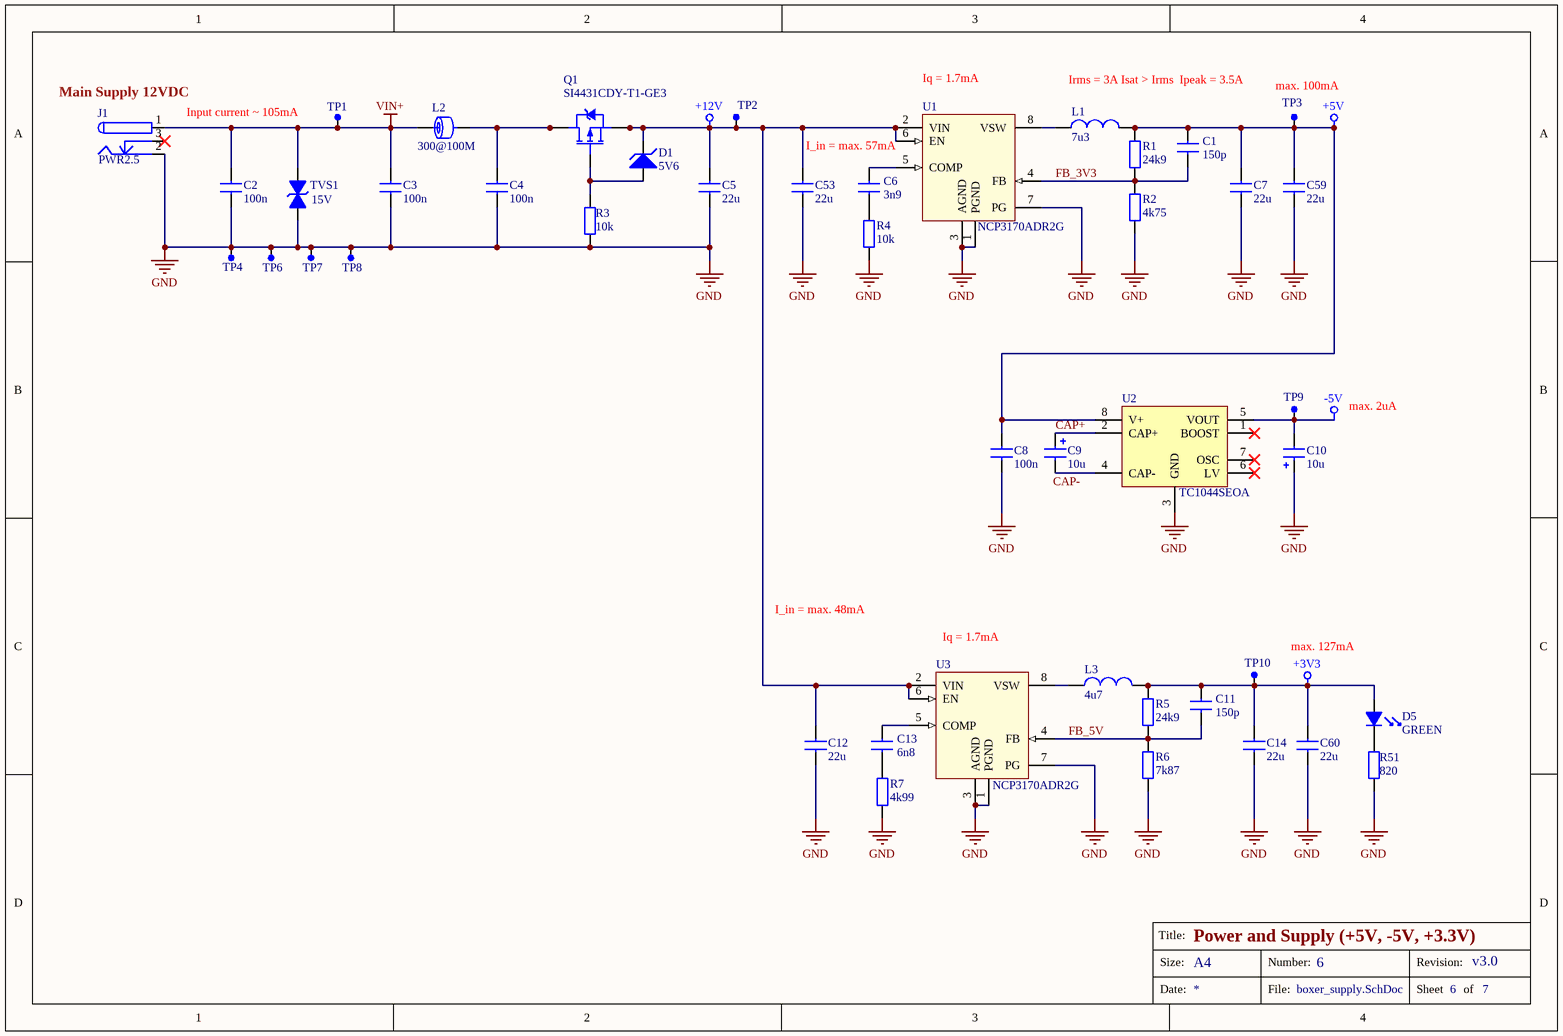
[diagram p4: boxer_supply.SchDoc]

### Parts
C1  value 150p  [C_0805]  (hidden comment: 885012207081)
C2  value 100n  [C_0805]  (hidden comment: Capacitor)
C3  value 100n  [C_0805]  (hidden comment: Capacitor)
C4  value 100n  [C_0805]  (hidden comment: Capacitor)
C5  value 22u  [C_1206]  (hidden comment: TME: CL31A226MOCLNNC)
C6  value 3n9  [C_0805]  (hidden comment: 885012207089)
C7  value 22u  [C_1206]  (hidden comment: TME: CL31A226MOCLNNC)
C8  value 100n  [C_0805]  (hidden comment: Capacitor)
C9  value 10u  [C_SMC]  (hidden comment: TAJC106K016R)
C10  value 10u  [C_SMC]  (hidden comment: TAJC106K016R)
C11  value 150p  [C_0805]  (hidden comment: 885012207081)
C12  value 22u  [C_1206]  (hidden comment: TME: CL31A226MOCLNNC)
C13  value 6n8  [C_0805]  (hidden comment: 885012207091)
C14  value 22u  [C_1206]  (hidden comment: TME: CL31A226MOCLNNC)
C53  value 22u  [C_1206]  (hidden comment: TME: CL31A226MOCLNNC)
C59  value 22u  [C_1206]  (hidden comment: TME: CL31A226MOCLNNC)
C60  value 22u  [C_1206]  (hidden comment: TME: CL31A226MOCLNNC)
D1  value 5V6  [D_SMA]  (hidden comment: MM3Z5V6B)
D5  value GREEN  [LED_0805]  (hidden comment: KP-2012LSGC)
J1  PWR2.5  [WE_WR_DC_694106301002]
L1  value 7u3  [L_6.7x6.7mm]  (hidden comment: 308-1500-1-ND)
L2  value 300@100M  [L_0805]  (hidden comment: 742792031)
L3  value 4u7  [L_3.8x3.8mm]  (hidden comment: 732-1008-1-ND)
Q1  SI4431CDY-T1-GE3  [SO8]
R1  value 24k9  [R_0805]  (hidden comment: RNCP0805FTD24K9)
R2  value 4k75  [R_0805]  (hidden comment: RNCP0805FTD4K75)
R3  value 10k  [R_1206]  (hidden comment: Resistor)
R4  value 10k  [R_1206]  (hidden comment: Resistor)
R5  value 24k9  [R_0805]  (hidden comment: RNCP0805FTD24K9)
R6  value 7k87  [R_0805]  (hidden comment: RC0805FR-077K87L)
R7  value 4k99  [R_0805]  (hidden comment: RMCF0805FT4K99)
R51  value 820  [R_0805]  (hidden comment: Resistor)
TP1  TEST PAD  [PIN]  (value not drawn)
TP2  TEST PAD  [PIN]  (value not drawn)
TP3  TEST PAD  [PIN]  (value not drawn)
TP4  TEST PAD  [PIN]  (value not drawn)
TP6  TEST PAD  [PIN]  (value not drawn)
TP7  TEST PAD  [PIN]  (value not drawn)
TP8  TEST PAD  [PIN]  (value not drawn)
TP9  TEST PAD  [PIN]  (value not drawn)
TP10  TEST PAD  [PIN]  (value not drawn)
TVS1  value 15V  [D_SMB]  (hidden comment: SM6T15CA)
U1  NCP3170ADR2G  [SO8]
U2  TC1044SEOA  [SO8]
U3  NCP3170ADR2G  [SO8]

### Nets
+3V3: C11.2 C14.2 C60.2 D5.1(A) L3.2 R5.2 TP10.1
+5V: C1.2 C7.2 C8.2 C59.2 L1.2 R1.2 TP3.1 U2.8(V+)
+12V: C5.2 C12.2 C53.2 D1.2(K) Q1.1(S) Q1.2(S) Q1.3(S) TP2.1 U1.2(VIN) U1.6(EN) U3.2(VIN) U3.6(EN)
-5V: C10.2 TP9.1 U2.5(VOUT)
GND: C2.1 C3.1 C4.1 C5.1 C7.1 C8.1 C10.1 C12.1 C14.1 C53.1 C59.1 C60.1 J1.2 R2.1 R3.1 R4.1 R6.1 R7.1 R51.1 TP4.1 TP6.1 TP7.1 TP8.1 TVS1.1(A) U1.1(PGND) U1.3(AGND) U1.7(PG) U2.3(GND) U3.1(PGND) U3.3(AGND) U3.7(PG)
VIN+: C2.2 C3.2 J1.1 L2.1 TP1.1 TVS1.2(K)
CAP+: C9.1 U2.2(CAP+)
CAP-: C9.2 U2.4(CAP-)
FB_3V3: C1.1 R1.1 R2.2 U1.4(FB)
FB_5V: C11.1 R5.1 R6.2 U3.4(FB)
NetC4_2: C4.2 L2.2 Q1.5(D) Q1.6(D) Q1.7(D) Q1.8(D)
NetC6_1: C6.1 R4.2
NetC6_2: C6.2 U1.5(COMP)
NetC13_1: C13.1 R7.2
NetC13_2: C13.2 U3.5(COMP)
NetD1_1: D1.1(A) Q1.4(G) R3.2
NetD5_2: D5.2(K) R51.2
NetL1_1: L1.1 U1.8(VSW)
NetL3_1: L3.1 U3.8(VSW)

Not connected (* = marked no-connect by the designer): J1 3*; U2 1(BOOST)* 6(LV)* 7(OSC)*

### Notes on the sheet
- (near J1) Main Supply 12VDC
- Input current ~ 105mA
- (near U1) Iq = 1.7mA
- Irms = 3A Isat > Irms  Ipeak = 3.5A
- (near TP3) max. 100mA
- I_in = max. 57mA
- max. 2uA
- I_in = max. 48mA
- (near U3) Iq = 1.7mA
- max. 127mA
- Title:
- Size:
- A4
- Number:
- Revision:
- Date:
- File:
- Sheet
- of

### Library data of the parts
C1 C5-C7 C11-C14 C53 C59 C60 = Capacitor
C9 C10 = Capacitor Polar: Polarized Capacitor
D1 = Diode Zener: Zener Diode
D5 = LED: Typical RED, GREEN, YELLOW, AMBER GaAs LED
J1 = PWR2.5: Low Voltage Power Supply Connector; ComponentLink1Description: Manufacturer Link; ComponentLink1URL: http://domino.kycon.com/internet/Products.html; Value: PWR2.5
L1 = Inductor: FIXED IND 7.3UH 2.1A 54 MOHM SMD
L2 = FB: Ferrite Bead
L3 = Inductor: FIXED IND 4.7UH 1.2A 105 MOHM
Q1 = MOSFET-P_SO8: P-Channel MOSFET; Value: SI4431CDY-T1-GE3
R1 R2 R5-R7 = Resistor
TP1-TP4 TP6-TP10 = TEST_PAD: PAD 1.5mm
TVS1 = Transil
U1 U3 = NCP3170: Synchronous PWM Switching Converter; Value: NCP3170ADR2G
U2 = TC1044S: Charge Pump DC-TO-DC Voltage Converter; Value: TC1044SEOA

## Sheet boxer_analog.SchDoc: RS485, Buzzer, 12V FAN
size A4; DrawnBy: Damian Dolewski; Engineer: Damian Dolewski; DocumentNumber: 4; Revision: v3.0; SheetNumber: 4; SheetTotal: 7
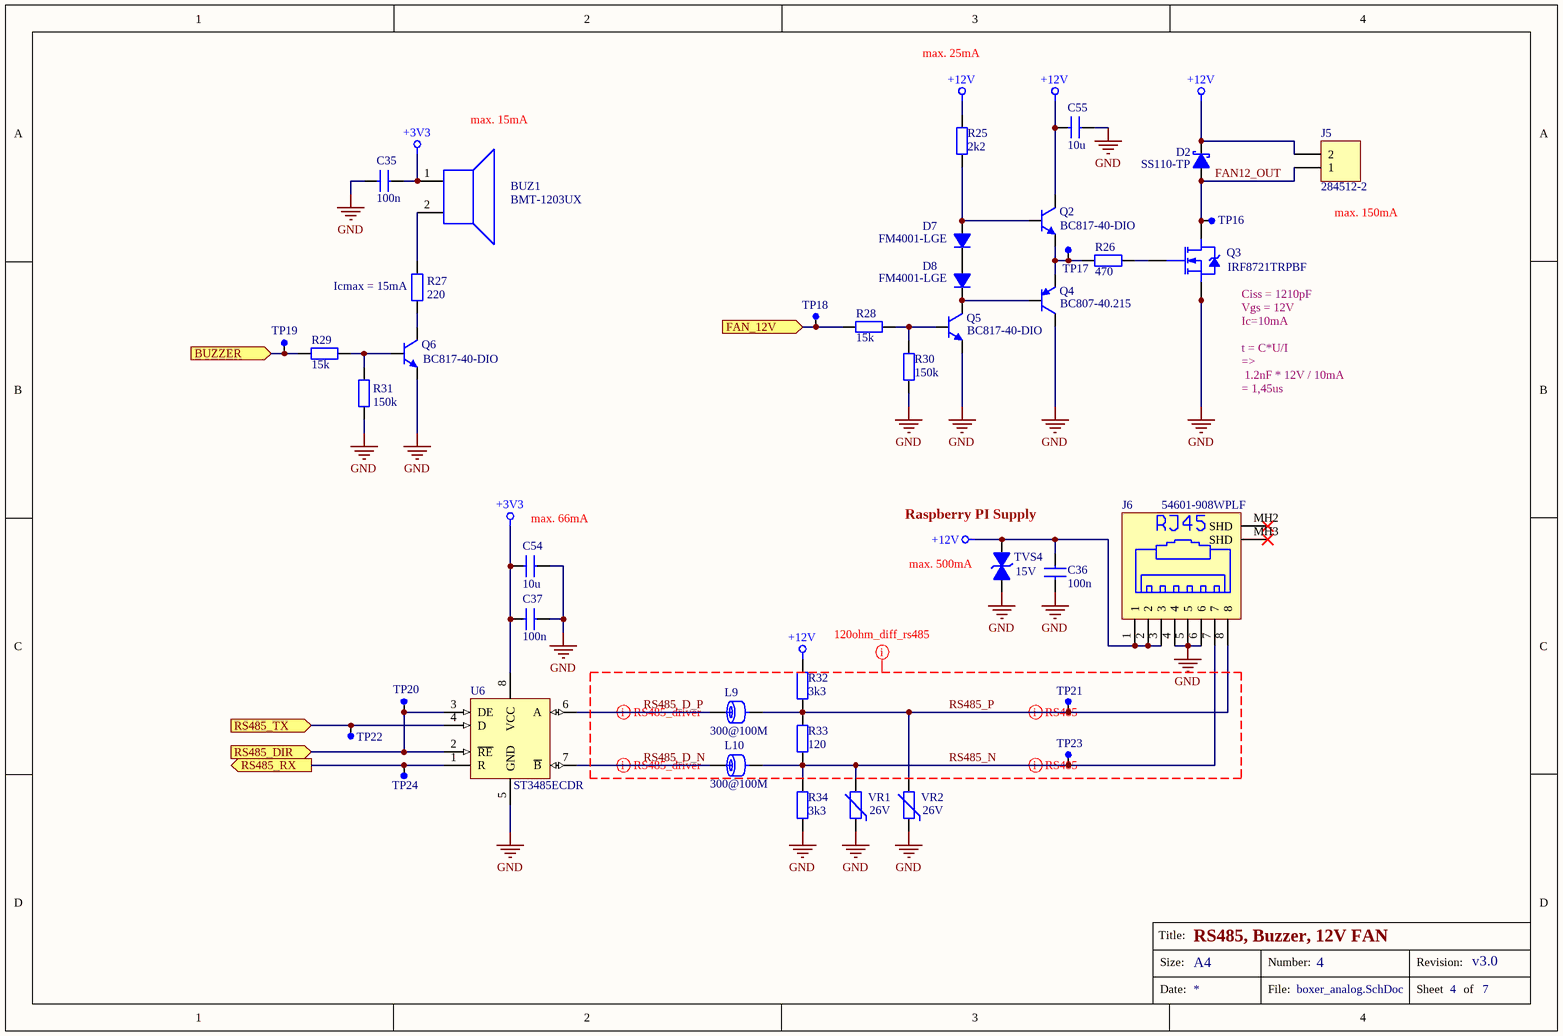
[diagram p5: boxer_analog.SchDoc]

### Parts
BUZ1  BMT-1203UX  [buzzer 7.6mm]
C35  value 100n  [C_0805]  (hidden comment: Capacitor)
C36  value 100n  [C_0805]  (hidden comment: Capacitor)
C37  value 100n  [C_0805]  (hidden comment: Capacitor)
C54  value 10u  [C_1206]  (hidden comment: TME: CL31A226MOCLNNC)
C55  value 10u  [C_1206]  (hidden comment: TME: CL31A226MOCLNNC)
D2  SS110-TP  [D_SMA]
D7  FM4001-LGE  [SOD123F]
D8  FM4001-LGE  [SOD123F]
J5  284512-2  [284512-2]
J6  54601-908WPLF  [RJ45_54601-908WPLF]
L9  value 300@100M  [L_0805]  (hidden comment: 742792031)
L10  value 300@100M  [L_0805]  (hidden comment: 742792031)
Q2  BC817-40-DIO  [SOT-23]
Q3  IRF8721TRPBF  [SO8]
Q4  BC807-40.215  [SOT-23]
Q5  BC817-40-DIO  [SOT-23]
Q6  BC817-40-DIO  [SOT-23]
R25  value 2k2  [R_0805]  (hidden comment: Resistor)
R26  value 470  [R_1206]  (hidden comment: Resistor)
R27  value 220  [R_0805]  (hidden comment: Resistor)
R28  value 15k  [R_0805]  (hidden comment: Resistor)
R29  value 15k  [R_0805]  (hidden comment: Resistor)
R30  value 150k  [R_0805]  (hidden comment: Resistor)
R31  value 150k  [R_0805]  (hidden comment: Resistor)
R32  value 3k3  [R_0805]  (hidden comment: Resistor)
R33  value 120  [R_0805]  (hidden comment: Resistor)
R34  value 3k3  [R_0805]  (hidden comment: Resistor)
TP16  TEST PAD  [PIN]  (value not drawn)
TP17  TEST PAD  [PIN]  (value not drawn)
TP18  TEST PAD  [PIN]  (value not drawn)
TP19  TEST PAD  [PIN]  (value not drawn)
TP20  TEST PAD  [PIN]  (value not drawn)
TP21  TEST PAD  [PIN]  (value not drawn)
TP22  TEST PAD  [PIN]  (value not drawn)
TP23  TEST PAD  [PIN]  (value not drawn)
TP24  TEST PAD  [PIN]  (value not drawn)
TVS4  value 15V  [D_SMB]  (hidden comment: SM6T15CA)
U6  ST3485ECDR  [SO8]
VR1  value 26V  [VR_0805]  (hidden comment: AMCV-0805-260-C800N-T)
VR2  value 26V  [VR_0805]  (hidden comment: AMCV-0805-260-C800N-T)

### Ports
BUZZER (in), FAN_12V (in), RS485_DIR (in), RS485_RX (out), RS485_TX (in)

### Nets
+3V3: BUZ1.1 C35.2 C37.1 C54.2 U6.8(VCC)
+12V: C36.1 C55.1 D2.2(K) J5.2 J6.1 J6.2 J6.3 Q2.3(C) R25.2 R32.2 TVS4.1(A)
GND: C35.1 C36.2 C37.2 C54.1 C55.2 J6.4 J6.5 J6.6 Q3.1(S) Q3.2(S) Q3.3(S) Q4.3(C) Q5.2(E) Q6.2(E) R30.1 R31.1 R34.1 TVS4.2(K) U6.5(GND) VR1.2 VR2.2
BUZZER: R29.1 TP19.1 ; port BUZZER
FAN12_OUT: D2.1(A) J5.1 Q3.5(D) Q3.6(D) Q3.7(D) Q3.8(D) TP16.1
FAN_12V: R28.1 TP18.1 ; port FAN_12V
RS485_D_N: L10.1 U6.7(~{B})
RS485_D_P: L9.1 U6.6(A)
RS485_DIR: TP20.1 U6.2(~{RE}) U6.3(DE) ; port RS485_DIR
RS485_N: J6.7 L10.2 R33.1 R34.2 TP23.1 VR1.1
RS485_P: J6.8 L9.2 R32.1 R33.2 TP21.1 VR2.1
RS485_RX: TP24.1 U6.1(R) ; port RS485_RX
RS485_TX: TP22.1 U6.4(D) ; port RS485_TX
NetBUZ1_2: BUZ1.2 R27.2
NetD7_1: D7.1(A) Q2.1(B) R25.1
NetD7_2: D7.2(K) D8.1(A)
NetD8_2: D8.2(K) Q4.1(B) Q5.3(C)
NetQ2_2: Q2.2(E) Q4.2(E) R26.2 TP17.1
NetQ3_4: Q3.4(G) R26.1
NetQ5_1: Q5.1(B) R28.2 R30.2
NetQ6_1: Q6.1(B) R29.2 R31.2
NetQ6_3: Q6.3(C) R27.1

Not connected (* = marked no-connect by the designer): J6 MH2(SHD)* MH3(SHD)*

### Layout directives
differential pair: RS485_D_N, RS485_D_P, RS485_N, RS485_P
net class 120ohm_diff_rs485; rule Impedance Constraint [Min = 115.0    Max = 125.0    ]: RS485_D_N, RS485_D_P, RS485_N, RS485_P

### Notes on the sheet
- max. 25mA
- max. 15mA
- (near J5) max. 150mA
- (near R27) Icmax = 15mA
- (near Q3) Ciss = 1210pF
  Vgs = 12V
  Ic=10mA
  t = C*U/I
  =>
  1.2nF * 12V / 10mA
  = 1,45us
- Raspberry PI Supply
- (near C54) max. 66mA
- (near TVS4) max. 500mA
- Title:
- Size:
- A4
- Number:
- Revision:
- Date:
- File:
- Sheet
- of

### Library data of the parts
BUZ1 = Buzzer: Value: BMT-1203UX
C54 C55 = Capacitor
D2 = Diode Schottky: Schottky Diode; Value: SS110-TP
D7 D8 = Diode: Value: FM4001-LGE
J5 = Header 2: Header, 2-Pin; Value: 284512-2
J6 = RJ45-8: as J10 on sheet boxer_main; Value: 54601-908WPLF
L9 L10 = FB: Ferrite Bead
Q2 Q5 Q6 = NPN: NPN Bipolar Transistor; Value: BC817-40-DIO
Q3 = MOSFET-N_SO8: N-Channel MOSFET; Value: IRF8721TRPBF
Q4 = PNP: Value: BC807-40.215
TP16-TP24 = TEST_PAD: PAD 1.5mm
TVS4 = Transil
U6 = ST485BDR: RS-422/RS-485 Interface IC Hi-Spd Lo Pwr Trans; ComponentLink1Description: Manufacturer Link; ComponentLink1URL: http://www.ti.com/; ComponentLink2Description: Datasheet; ComponentLink2URL: http://www-s.ti.com/sc/ds/sn75176b.pdf; Value: ST3485ECDR
VR1 VR2 = Varistor: as VR3 on sheet boxer_irrigation

## Sheet boxer_I2C_diff.SchDoc: Differential I2C
size A4; DrawnBy: Damian Dolewski; Engineer: Damian Dolewski; DocumentNumber: 5; Revision: v3.0; SheetNumber: 7; SheetTotal: 7
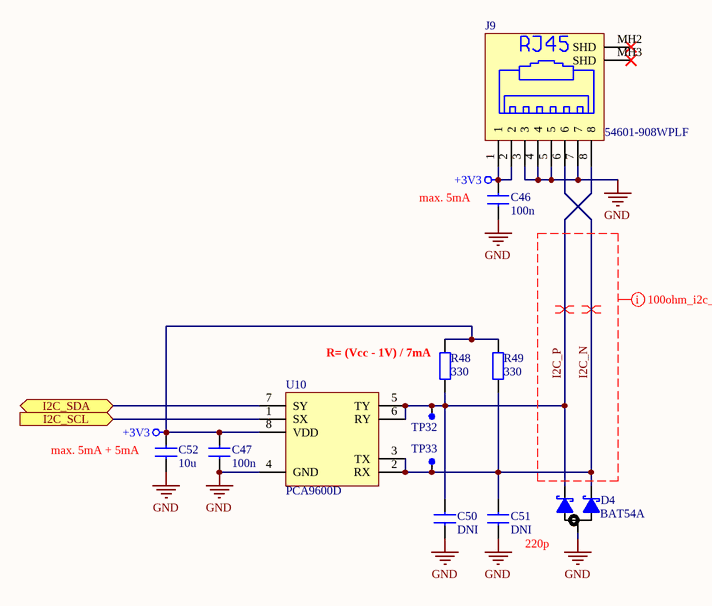
[diagram p6: boxer_I2C_diff.SchDoc]

### Parts
C46  value 100n  [C_0805]  (hidden comment: Capacitor)
C47  value 100n  [C_0805]  (hidden comment: Capacitor)
C50  value DNI  [C_0805]  (hidden comment: Capacitor)
C51  value DNI  [C_0805]  (hidden comment: Capacitor)
C52  value 10u  [C_1206]  (hidden comment: Capacitor)
D4  BAT54A  [SOT-23]
J9  54601-908WPLF  [RJ45_54601-908WPLF]
R48  value 330  [R_0805]  (hidden comment: Resistor)
R49  value 330  [R_0805]  (hidden comment: Resistor)
TP32  TEST PAD  [PIN]  (value not drawn)
TP33  TEST PAD  [PIN]  (value not drawn)
U10  PCA9600D  [SO8]

### Ports
I2C_SCL (in), I2C_SDA (bidir)

### Nets
+3V3: C46.2 C47.2 C52.2 J9.1 J9.2 R48.2 R49.2 U10.8(VDD)
GND: C46.1 C47.1 C50.1 C51.1 C52.1 D4.3(K) J9.3 J9.4 J9.5 J9.7 U10.4(GND)
I2C_N: C51.2 D4.1(A) J9.6 R49.1 TP33.1 U10.2(RX) U10.3(TX)
I2C_P: C50.2 D4.2(A) J9.8 R48.1 TP32.1 U10.5(TY) U10.6(RY)
I2C_SCL: U10.1(SX) ; port I2C_SCL
I2C_SDA: U10.7(SY) ; port I2C_SDA

Not connected (* = marked no-connect by the designer): J9 MH2(SHD)* MH3(SHD)*

### Layout directives
differential pair: I2C_N, I2C_P
mark named 100ohm_i2c_diff: I2C_N, I2C_P

### Notes on the sheet
- (near C46) max. 5mA
- (near R48) R= (Vcc - 1V) / 7mA
- (near C52) max. 5mA + 5mA
- 220p
- Title:
- Size:
- A4
- Number:
- Revision:
- Date:
- File:
- Sheet
- of

### Library data of the parts
D4 = Diode Schottky3: dual Schottky diode common anode; Value: BAT54A
J9 = RJ45-8: as J10 on sheet boxer_main; Value: 54601-908WPLF
TP32 TP33 = TEST_PAD
U10 = PCA9600: Dual bidirectional I2C bus buffer; Value: PCA9600D

## Nets that join several sheets
+3V3: boxer_main (C58.2 L6.2 R53.2 R54.2), boxer_irrigation (R40.2 R41.2 R44.2), boxer_stm32 (C15.2 C21.2 L4.1 L5.1), boxer_supply (7 pins), boxer_analog (5 pins), boxer_I2C_diff (8 pins)
+5V: boxer_main (5 pins), boxer_irrigation (6 pins), PH1 (C63A.2 L8A.1), PH2 (C63B.2 L8B.1), boxer_supply (8 pins)
+12V: boxer_irrigation (9 pins), boxer_supply (12 pins), boxer_analog (11 pins)
-5V: PH1 (C28A.2 L7A.2), PH2 (C28B.2 L7B.2), boxer_supply (C10.2 TP9.1 U2.5)
GND: boxer_main (16 pins), boxer_irrigation (33 pins), boxer_stm32 (23 pins), PH1 (11 pins), PH2 (11 pins), boxer_supply (31 pins), boxer_analog (21 pins), boxer_I2C_diff (11 pins)
AC_SIG03V: boxer_main (C64.1 R55.2), boxer_stm32 (U4.26)
BUZZER: boxer_stm32 (U4.12), boxer_analog (R29.1 TP19.1)
FAN_12V: boxer_stm32 (U4.15), boxer_analog (R28.1 TP18.1)
FAN_230V: boxer_main (J10.8 TP36.1 TVS6.2), boxer_stm32 (U4.27)
I2C_SCL: boxer_stm32 (R10.1 TP13.1 U4.29), boxer_I2C_diff (U10.1)
I2C_SDA: boxer_stm32 (R9.1 TP12.1 U4.30), boxer_I2C_diff (U10.7)
LED_LAMP: boxer_main (J10.4 TP35.1 TVS7.2), boxer_stm32 (U4.25)
O_WIRE: boxer_main (J11.3 TP37.1 TVS9.2), boxer_stm32 (R11.2 U4.28)
PH_OUT1: boxer_stm32 (U4.6), PH1 (C31A.2 R19A.2 TP15A.1)
PH_OUT2: boxer_stm32 (U4.7), PH2 (C31B.2 R19B.2 TP15B.1)
PUMP: boxer_irrigation (R38.1 TP27.1), boxer_stm32 (U4.14)
RS485_DIR: boxer_stm32 (U4.18), boxer_analog (TP20.1 U6.2 U6.3)
RS485_RX: boxer_stm32 (R8.1 U4.20), boxer_analog (TP24.1 U6.1)
RS485_TX: boxer_stm32 (U4.19), boxer_analog (TP22.1 U6.4)
SOIL_MOIST: boxer_irrigation (R45.1 R46.2 TP31.1), boxer_stm32 (U4.13)
WATER_FLOW: boxer_irrigation (R44.1 TP39.1 U9.3), boxer_stm32 (U4.11)
WATER_LEVEL_H: boxer_irrigation (R40.1 TP5.1 U7.3), boxer_stm32 (U4.10)
WATER_LEVEL_L: boxer_irrigation (R41.1 TP38.1 U8.3), boxer_stm32 (U4.9)

## Assembly variants
Default: not fitted R5 R55